# Altium schematic sheet MCU.SchDoc
size A3; SheetNumber: 4; SheetTotal: 6
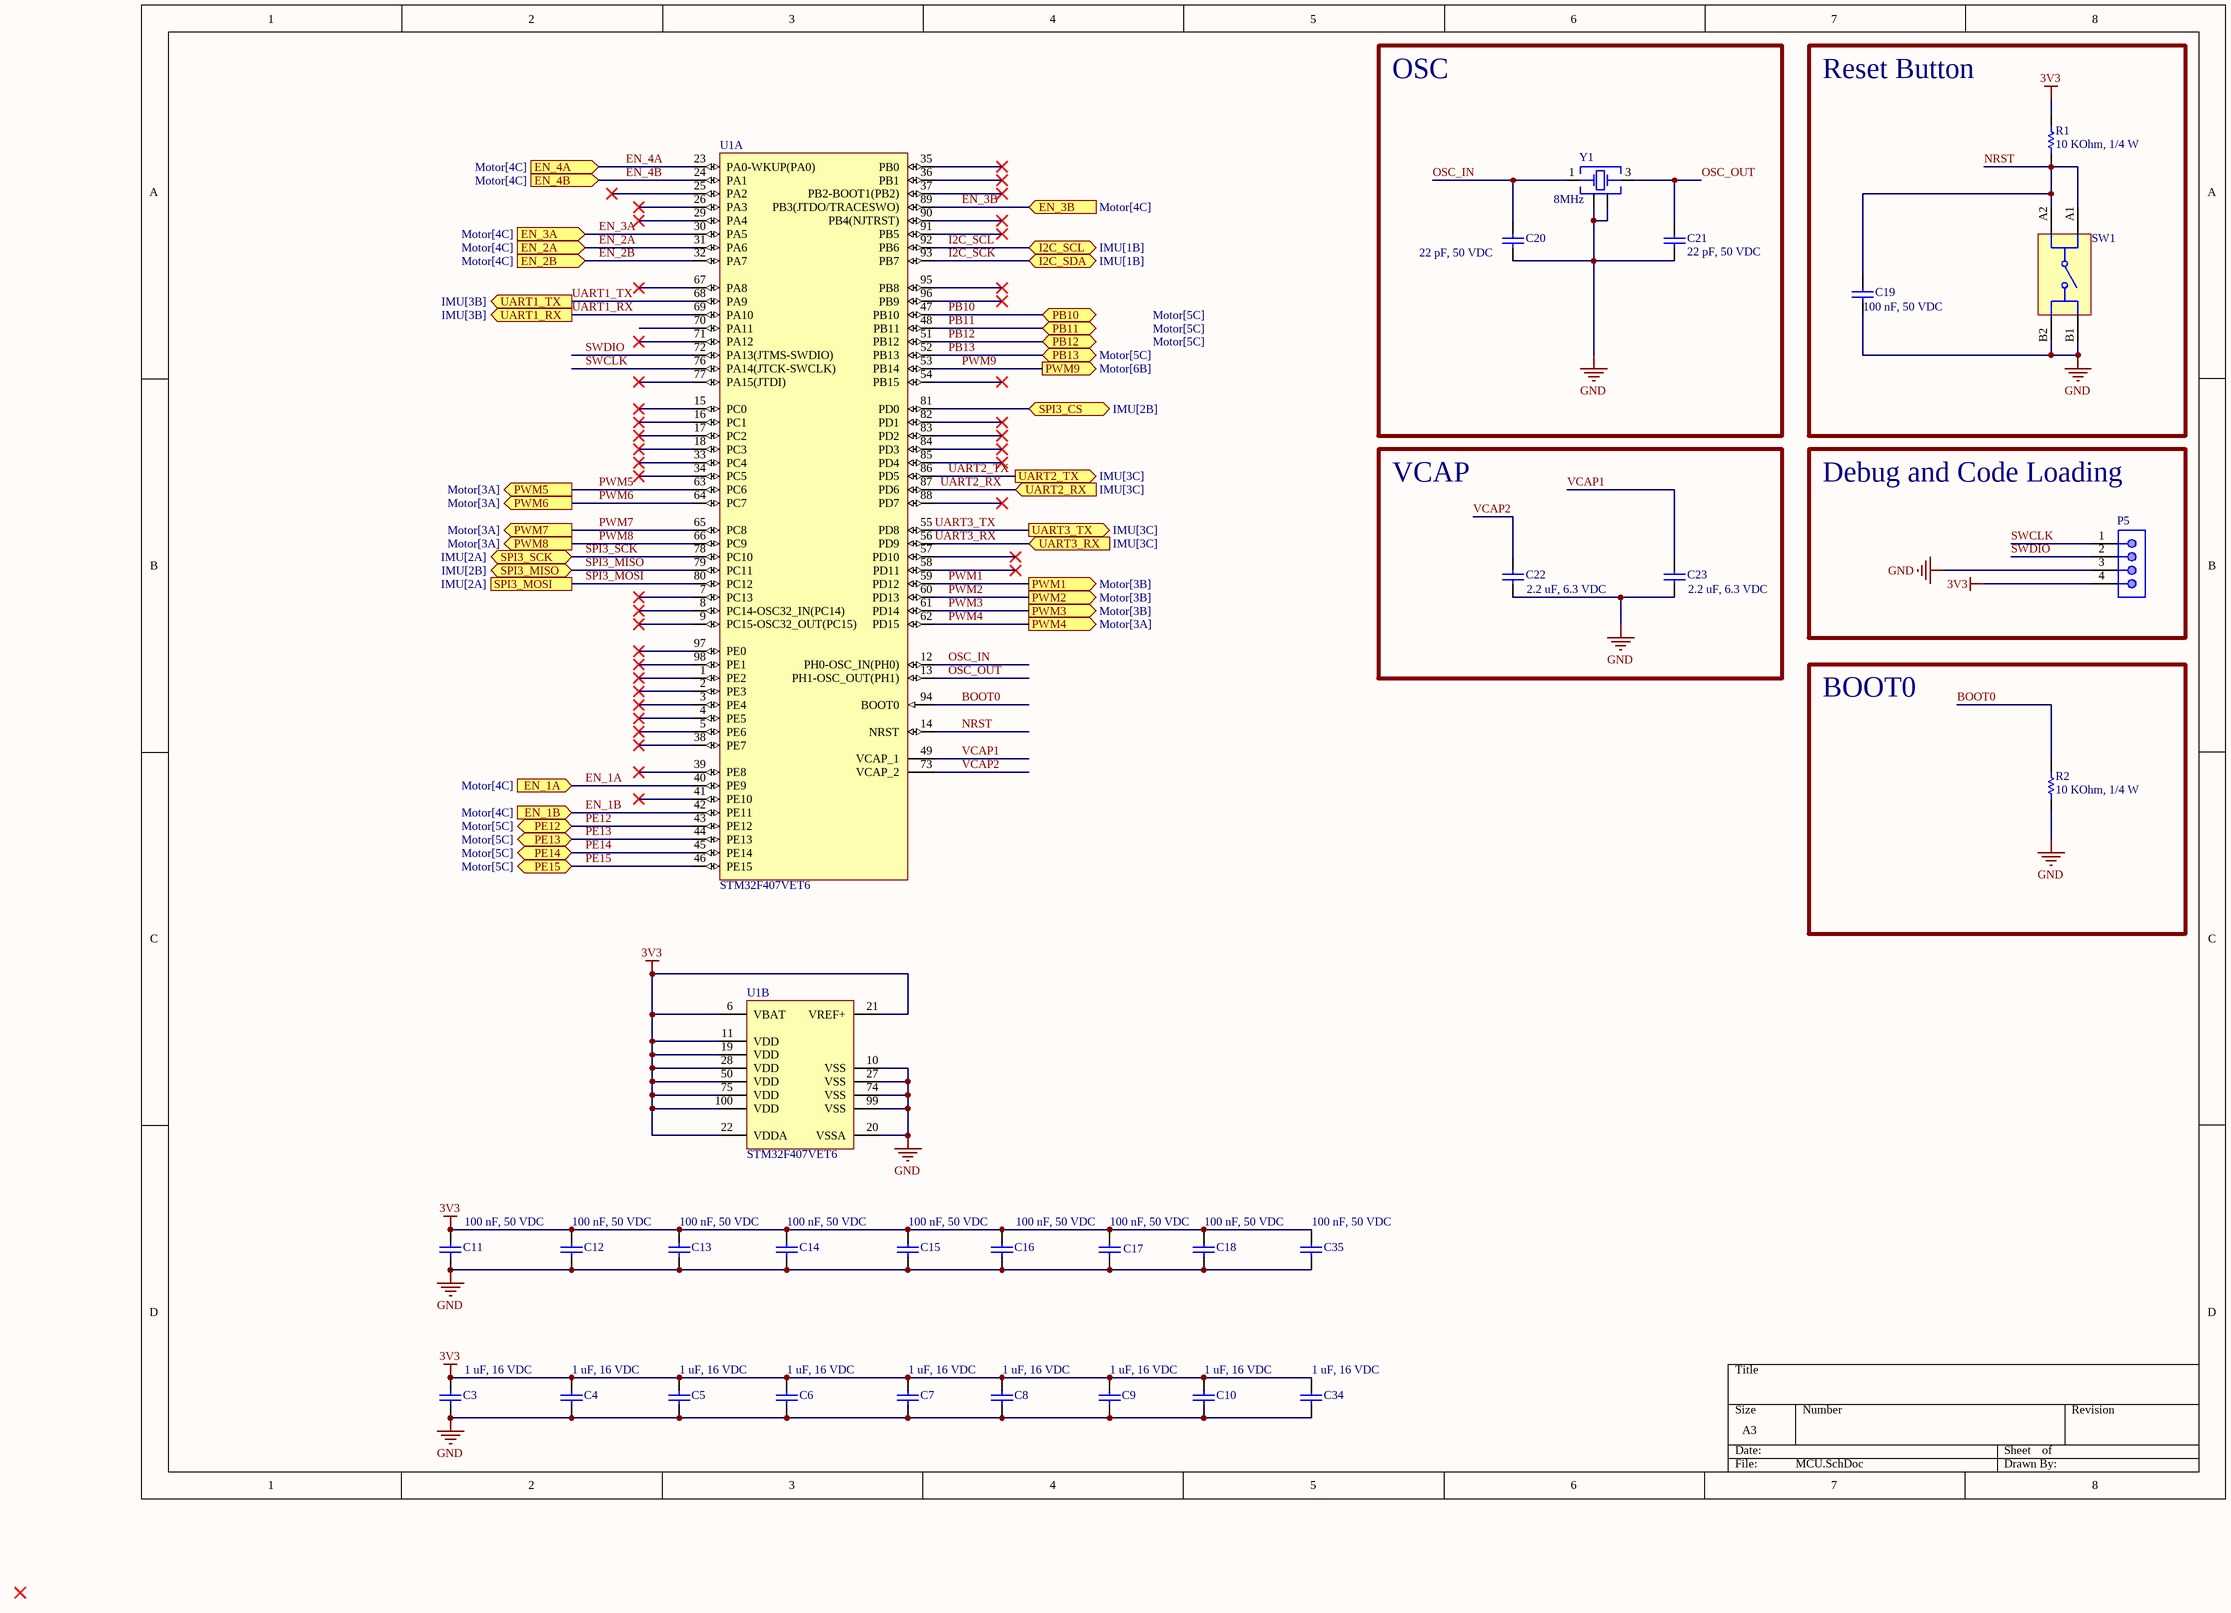
[diagram p0: MCU.SchDoc]

## Parts
C3  1 uF, 16 VDC  [CAP_0603]
C4  1 uF, 16 VDC  [CAP_0603]
C5  1 uF, 16 VDC  [CAP_0603]
C6  1 uF, 16 VDC  [CAP_0603]
C7  1 uF, 16 VDC  [CAP_0603]
C8  1 uF, 16 VDC  [CAP_0603]
C9  1 uF, 16 VDC  [CAP_0603]
C10  1 uF, 16 VDC  [CAP_0603]
C11  100 nF, 50 VDC  [CAP_0603]
C12  100 nF, 50 VDC  [CAP_0603]
C13  100 nF, 50 VDC  [CAP_0603]
C14  100 nF, 50 VDC  [CAP_0603]
C15  100 nF, 50 VDC  [CAP_0603]
C16  100 nF, 50 VDC  [CAP_0603]
C17  100 nF, 50 VDC  [CAP_0603]
C18  100 nF, 50 VDC  [CAP_0603]
C19  100 nF, 50 VDC  [CAP_0603]
C20  22 pF, 50 VDC  [CAP_0603]
C21  22 pF, 50 VDC  [CAP_0603]
C22  2.2 uF, 6.3 VDC  [CAP_0603]
C23  2.2 uF, 6.3 VDC  [CAP_0603]
C34  1 uF, 16 VDC  [CAP_0603]
C35  100 nF, 50 VDC  [CAP_0603]
P5  61300411121  [61300411121]  (value not drawn)
R1  10 KOhm, 1/4 W  [resistor_0603]
R2  10 KOhm, 1/4 W  [resistor_0603]
SW1  430483035816  [WS-TASV_L6W6H3.5_4304x30358x6]  (value not drawn)
U1  STM32F407VET6  [STM-LQFP100_V]  (parts A,B of 2)
Y1  8MHz  [WE-XTAL_CFPX-104]

## Blocks framed on the sheet
OSC: C20 C21 Y1
Reset Button: C19 R1 SW1
VCAP: C22 C23
Debug and Code Loading: P5
BOOT0: R2

## Ports
EN_1A (in, see Motor[4C]), EN_1B (in, see Motor[4C]), EN_2A (in, see Motor[4C]), EN_2B (in, see Motor[4C]), EN_3A (in, see Motor[4C]), EN_3B (in, see Motor[4C]), EN_4A (in, see Motor[4C]), EN_4B (in, see Motor[4C]), I2C_SCL (bidir, see IMU[1B]), I2C_SDA (bidir, see IMU[1B]), PB10 (bidir, see Motor[5C]), PB11 (bidir, see Motor[5C]), PB12 (bidir, see Motor[5C]), PB13 (bidir, see Motor[5C]), PE12 (bidir, see Motor[5C]), PE13 (bidir, see Motor[5C]), PE14 (bidir, see Motor[5C]), PE15 (bidir, see Motor[5C]), PWM1 (out, see Motor[3B]), PWM2 (out, see Motor[3B]), PWM3 (out, see Motor[3B]), PWM4 (out, see Motor[3A]), PWM5 (out, see Motor[3A]), PWM6 (out, see Motor[3A]), PWM7 (out, see Motor[3A]), PWM8 (out, see Motor[3A]), PWM9 (out, see Motor[6B]), SPI3_CS (bidir, see IMU[2B]), SPI3_MISO (bidir, see IMU[2B]), SPI3_MOSI (see IMU[2A]), SPI3_SCK (bidir, see IMU[2A]), UART1_RX (out, see IMU[3B]), UART1_TX (out, see IMU[3B]), UART2_RX (in, see IMU[3C]), UART2_TX (out, see IMU[3C]), UART3_RX (in, see IMU[3C]), UART3_TX (out, see IMU[3C])

## Nets
3V3: C3.2 C4.2 C5.2 C6.2 C7.2 C8.2 C9.2 C10.2 C11.2 C12.2 C13.2 C14.2 C15.2 C16.2 C17.2 C18.2 C34.2 C35.2 P5.4 R1.2 U1.6(VBAT) U1.11(VDD) U1.19(VDD) U1.21(VREF+) U1.22(VDDA) U1.28(VDD) U1.50(VDD) U1.75(VDD) U1.100(VDD)
GND: C3.1 C4.1 C5.1 C6.1 C7.1 C8.1 C9.1 C10.1 C11.1 C12.1 C13.1 C14.1 C15.1 C16.1 C17.1 C18.1 C19.1 C20.1 C21.1 C22.1 C23.1 C34.1 C35.1 P5.3 R2.1 SW1.B1 SW1.B2 U1.10(VSS) U1.20(VSSA) U1.27(VSS) U1.74(VSS) U1.99(VSS) Y1.2(GND) Y1.4(GND)
BOOT0: R2.2 U1.94(BOOT0)
EN_1A: U1.40(PE9) ; port EN_1A
EN_1B: U1.42(PE11) ; port EN_1B
EN_2A: U1.31(PA6) ; port EN_2A
EN_2B: U1.32(PA7) ; port EN_2B
EN_3A: U1.30(PA5) ; port EN_3A
EN_3B: U1.89(PB3(JTDO/TRACESWO)) ; port EN_3B
EN_4A: U1.23(PA0-WKUP(PA0)) ; port EN_4A
EN_4B: U1.24(PA1) ; port EN_4B
I2C_SCK: U1.93(PB7) ; port I2C_SDA
I2C_SCL: U1.92(PB6) ; port I2C_SCL
NRST: C19.2 R1.1 SW1.A1 SW1.A2 U1.14(NRST)
OSC_IN: C20.2 U1.12(PH0-OSC_IN(PH0)) Y1.1(OSC1)
OSC_OUT: C21.2 U1.13(PH1-OSC_OUT(PH1)) Y1.3(OSC2)
PB10: U1.47(PB10) ; port PB10
PB11: U1.48(PB11) ; port PB11
PB12: U1.51(PB12) ; port PB12
PB13: U1.52(PB13) ; port PB13
PE12: U1.43(PE12) ; port PE12
PE13: U1.44(PE13) ; port PE13
PE14: U1.45(PE14) ; port PE14
PE15: U1.46(PE15) ; port PE15
PWM1: U1.59(PD12) ; port PWM1
PWM2: U1.60(PD13) ; port PWM2
PWM3: U1.61(PD14) ; port PWM3
PWM4: U1.62(PD15) ; port PWM4
PWM5: U1.63(PC6) ; port PWM5
PWM6: U1.64(PC7) ; port PWM6
PWM7: U1.65(PC8) ; port PWM7
PWM8: U1.66(PC9) ; port PWM8
PWM9: U1.53(PB14) ; port PWM9
SPI3_CS: U1.81(PD0) ; port SPI3_CS
SPI3_MISO: U1.79(PC11) ; port SPI3_MISO
SPI3_MOSI: U1.80(PC12) ; port SPI3_MOSI
SPI3_SCK: U1.78(PC10) ; port SPI3_SCK
SWCLK: P5.1 U1.76(PA14(JTCK-SWCLK))
SWDIO: P5.2 U1.72(PA13(JTMS-SWDIO))
UART1_RX: U1.69(PA10) ; port UART1_RX
UART1_TX: U1.68(PA9) ; port UART1_TX
UART2_RX: U1.87(PD6) ; port UART2_RX
UART2_TX: U1.86(PD5) ; port UART2_TX
UART3_RX: U1.56(PD9) ; port UART3_RX
UART3_TX: U1.55(PD8) ; port UART3_TX
VCAP1: C23.2 U1.49(VCAP_1)
VCAP2: C22.2 U1.73(VCAP_2)

Not connected (* = marked no-connect by the designer): U1 1(PE2)* 2(PE3)* 3(PE4)* 4(PE5)* 5(PE6)* 7(PC13)* 8(PC14-OSC32_IN(PC14))* 9(PC15-OSC32_OUT(PC15))* 15(PC0)* 16(PC1)* 17(PC2)* 18(PC3)* 25(PA2)* 26(PA3)* 29(PA4)* 33(PC4)* 34(PC5)* 35(PB0)* 36(PB1)* 37(PB2-BOOT1(PB2))* 38(PE7)* 39(PE8)* 41(PE10)* 54(PB15)* 57(PD10)* 58(PD11)* 67(PA8)* 70(PA11) 71(PA12)* 77(PA15(JTDI))* 82(PD1)* 83(PD2)* 84(PD3)* 85(PD4)* 88(PD7)* 90(PB4(NJTRST))* 91(PB5)* 95(PB8)* 96(PB9)* 97(PE0)* 98(PE1)*

## Library data of the parts
C3-C10 C34 = 0106031051016: CAP, size 0603, 1 uF, 16 VDC; Manufacture Name: Samsung Electro-Mechanics; Manufacture SN: CL10B105KO8NNWC; Capacitance: 1 uF; Tolerance: +/-10%; Voltage Rating DC: 16 VDC; ComponentLink2Description: Datasheet; ComponentLink2URL: https://www.mouser.vn/datasheet/2/585/Samsung_MLCC_1837944-1929650.pdf; Operating Temperature: -55 to +125degC; Packaging: Tape and Reel; Mounting Technology: SMT; Size: 0603; Supplier 1 Name: Mouser; Supplier 1 SN: 187-CL10B105KO8NNWC; Supplier 1 URL: https://www.mouser.vn/ProductDetail/Samsung-Electro-Mechanics/CL10B105KO8NNWC?qs=81r%252BiQLm7BT%252BXtc72qn1ug%3D%3D&utm_source=mouser-refine-download&utm_medium=file&utm_campaign=CL10B105KO8NNWC&utm_content=Samsung-Electro-Mechanics; Supplier 2 Name: Digi-Key; Supplier 2 SN: 1276-CL10B105KO8NNWCTR-ND; Supplier 2 URL: https://www.digikey.com/en/products/detail/samsung-electro-mechanics/cl10b105ko8nnwc/16572783; Supplier 3 Name: thegioiic; Supplier 3 SN: N/A; Supplier 3 URL: https://www.thegioiic.com/tu-gom-0603-1uf-16v; Value: 1 uF, 16 VDC
C11-C19 C35 = 0106031041050: CAP, size 0603, 100 nF, 50 VDC; Manufacture Name: TDK; Manufacture SN: CGA3E3X8R1H104K080AE; Capacitance: 100 nF; Tolerance: +/-10%; Voltage Rating DC: 50 VDC; ComponentLink2Description: Datasheet; ComponentLink2URL: https://product.tdk.com/system/files/dam/doc/product/capacitor/ceramic/mlcc/catalog/mlcc_automotive_soft_en.pdf?ref_disty=mouser; Operating Temperature: -55 to +125degC; Packaging: Tape and Reel; Mounting Technology: SMT; Size: 0603; Supplier 1 Name: Mouser; Supplier 1 SN: 810-CGA3E3X8R1H104KA; Supplier 1 URL: https://www.mouser.com/ProductDetail/TDK/CGA3E3X8R1H104K080AE?qs=nQSIdc08i%252Bd8g3IRRgU2bw%3D%3D&utm_source=mouser-refine-download&utm_medium=file&utm_campaign=CGA3E3X8R1H104K080AE&utm_content=TDK; Supplier 2 Name: Digi-Key; Supplier 2 SN: 445-173697-2-ND; Supplier 2 URL: https://www.digikey.com/en/products/detail/tdk-corporation/cga3e3x8r1h104k080ae/5809262; Supplier 3 Name: thegioiic; Supplier 3 SN: N/A; Supplier 3 URL: N/A; Value: 100 nF, 50 VDC
C20 C21 = 0106032200550: CAP, size 0603, 22 pF, 50 VDC; Manufacture Name: TDK; Manufacture SN: CGA3E2NP01H220J080AA; Capacitance: 22 pF; Tolerance: +/-5%; Voltage Rating DC: 50 VDC; ComponentLink2Description: Datasheet; ComponentLink2URL: https://product.tdk.com/system/files/dam/doc/product/capacitor/ceramic/mlcc/catalog/mlcc_automotive_hightemp_en.pdf?ref_disty=mouser; Operating Temperature: -55 to +125degC; Packaging: Tape and Reel; Mounting Technology: SMT; Size: 0603; Supplier 1 Name: Mouser; Supplier 1 SN: 810-CGA3E2NP01H220JA; Supplier 1 URL: https://www.mouser.com/ProductDetail/TDK/CGA3E2NP01H220J080AA?qs=xLDY6iXSiQbIDiPJq57tVA%3D%3D&utm_source=mouser-refine-download&utm_medium=file&utm_campaign=CGA3E2NP01H220J080AA&utm_content=TDK; Supplier 2 Name: Digi-Key; Supplier 2 SN: 445-12401-2-ND; Supplier 2 URL: https://www.digikey.com/en/products/detail/tdk-corporation/cga3e2np01h220j080aa/3949637; Supplier 3 Name: thegioiic; Supplier 3 SN: N/A; Supplier 3 URL: N/A; Value: 22 pF, 50 VDC
C22 C23 = 010603225106.3: CAP, size 0603, 2.2 uF, 6.3 VDC; Manufacture Name: Samsung Electro-Mechanics; Manufacture SN: CL10B225KQ8NNNC; Capacitance: 2.2 uF; Tolerance: +/-10%; Voltage Rating DC: 6.3 VDC; ComponentLink2Description: Datasheet; ComponentLink2URL: https://www.mouser.vn/datasheet/2/585/MLCC-1837944.pdf; Operating Temperature: -55 to +125degC; Packaging: Tape and Reel; Mounting Technology: SMT; Size: 0603; Supplier 1 Name: Mouser; Supplier 1 SN: 187-CL10B225KQ8NNNC; Supplier 1 URL: https://www.mouser.vn/ProductDetail/Samsung-Electro-Mechanics/CL10B225KQ8NNNC?qs=349EhDEZ59rhKTQnNCSlcg%3D%3D&utm_source=mouser-refine-download&utm_medium=file&utm_campaign=CL10B225KQ8NNNC&utm_content=Samsung-Electro-Mechanics; Supplier 2 Name: Digi-Key; Supplier 2 SN: 1276-2018-2-ND; Supplier 2 URL: https://www.digikey.com/en/products/detail/samsung-electro-mechanics/cl10b225kq8nnnc/3887676; Supplier 3 Name: thegioiic; Supplier 3 SN: N/A; Supplier 3 URL: N/A; Value: 2.2 uF, 6.3 VDC
P5 = 61300411121: WR-PHD Pin Header, THT, pitch 2.54mm, Single Row, Vertical, 4p; Manufacturer: Wurth Elektronik; Pin Number: 4; Rated Current: 3A; Working Voltage: 250VAC; Withstanding Voltage: 500VAC; Contact Resistance: 20mOhm; Supply Name 1: Mouser; ComponentLink1Description: Manufacturer; ComponentLink1URL: http://www.we-online.de; ComponentLink2Description: Datasheet; ComponentLink2URL: https://www.we-online.com/catalog/datasheet/61300411121.pdf; Manufacturer Part Number: 61300411121; Published Date: May 2020; Pitch: 2.54mm; Operating Temperature: -40 to +105degC; Mounting Technology: THT; Packaging: Bag; Gender: Pin Header; Row Number: Single; Orientation: Vertical; ComponentLink3Description: Global Supply; ComponentLink3URL: https://www.we-online.com/en/components/products/PHD_2_54_THT_PIN_HEADER_6130XX11121?sq=61300411121#61300411121; ComponentLink4Description: Global Supply; ComponentLink4URL: https://www.mouser.vn/ProductDetail/Wurth-Elektronik/61300411121?qs=PhR8RmCirEYQcLLqXD8rAA%3D%3D; Supplier 1 Name: Mouser; Supplier 1 SN: 710-61300311121; Supplier 1 URL: https://www.mouser.vn/ProductDetail/Wurth-Elektronik/61300311121?qs=PhR8RmCirEYxRWFJzNKsUw%3D%3D; Supplier 2 Name: Digi-Key; Supplier 2 SN: N/A; Supplier 2 URL: N/A; Supplier 3 Name: thegioiic; Supplier 3 SN: N/A; Supplier 3 URL: N/A
R1 R2 = 0006031031: RES, size 0603, 10 KOhm, 1/4 W; Manufacture  Name: OEM; Resistance: 10 KOhm; Rated Power: 1/4 W; Resistance Tolerance: +/-1%; Size: 0603; Mounting Technology: SMT; Supplier 1 Name: Mouser; Supplier 1 SN: 755-ESR03EZPF1002; Supplier 2 Name: Digi-Key; Supplier 2 SN: RHM10KADTR-ND RHM10KADCT-ND RHM10KADDKR-ND; Supplier 1 URL: https://www.mouser.vn/ProductDetail/ROHM-Semiconductor/ESR03EZPF1002?qs=sGAEpiMZZMvdGkrng054t67Efho1F8r6CDeAsqwFse8%3D; Supplier 3 Name: thegioiic; Supplier 3 SN: N/A; Supplier 3 URL: N/A; Manufacture  SN: OEM; Value: 10 KOhm, 1/4 W; ComponentLink1Description: Datasheet link; ComponentLink1URL: https://fscdn.rohm.com/en/products/databook/datasheet/passive/resistor/chip_resistor/esr-e.pdf; ComponentLink2Description: Supplier 1 URL; ComponentLink2URL: N/A; ComponentLink3Description: Supplier 2 URL; ComponentLink3URL: https://www.digikey.com/en/products/detail/rohm-semiconductor/ESR03EZPF1002/1983429; ComponentLink4Description: Supplier 3 URL; ComponentLink4URL: N/A; Supplier 2 URL: https://www.digikey.com/en/products/detail/rohm-semiconductor/ESR03EZPF1002/1983429
SW1 = 430483035816: WS-TASV J-Bend SMT Washable Tact Switch, 12VDC, 50mA, 160g, height 3.5mm; Manufacturer: Wurth Elektronik; Rated Voltage: 12V; Washable: Yes; Actuator Color: Black; Electrical Life: 1000000Cycles; ComponentLink1Description: Manufacturer Link; ComponentLink1URL: http://www.we-online.de; ComponentLink2Description: Datasheet; ComponentLink2URL: https://www.we-online.com/catalog/datasheet/430483035816.pdf; Manufacturer Part Number: 430483035816; Contact Material: Stainless Steel; Mounting Technology: SMT; Contact Plating: Silver; Operation Force: 160g; Packaging: Tape and Reel; Terminal Material: Copper Alloy; Rated Current: 50mA; Terminal Plating: Silver; Height: 3.5mm; Length: 6mm; Operating Temperature max.: 85C; Operating Temperature min.: -40C; Width: 6mm
U1 = CMP-0243-00016-3: ARM Cortex-M4 32-bit MCU+FPU, 210 DMIPS, 512 kB Flash, 192 kB Internal RAM, 82 I/Os, 100-pin LQFP, -40 to 85 degC, Tray; Manufacturer: STMicroelectronics; Supply Voltage(Vcc) max (V): 3.6; Supply Voltage(Vcc) min (V): 1.8; I/Os (High Current): 82; FLASH Size (Prog) (kB): 512; Operating Frequency(F) (Processor speed) (MHz): 168; D/A Converter: 2x12-bit; Internal RAM Size (kB): 192; PackageReference: LQFP100; Core: ARM Cortex-M4; ComponentLink1URL: http://www.st.com/web/en/home.html; ComponentLink1Description: Manufacturer URL; DatasheetVersion: Rev. 4; Packing: Tray; Mounting Technology: Surface Mount; ComponentLink2Description: Datasheet; ComponentLink2URL: http://www.st.com/st-web-ui/static/active/en/resource/technical/document/datasheet/DM00037051.pdf; ComponentLink3Description: Package Specification; PartNumber: STM32F407VET6; PackageVersion: Rev. 1, 06/2013; PackageDescription: 100-Pin Low Profile Quad Flat Package, 14 x 14 mm Body, 0.5 mm Pitch; ComponentLink3URL: http://www.st.com/st-web-ui/static/active/en/resource/technical/document/data_brief/DM00071938.pdf
Y1 = 830106162701: WE-XTAL Quartz Crystal, SMT, CFPX-104, 8MHz, +/-20ppm; Manufacturer: Wurth Elektronik; Frequency Stability: +/-30ppm; Load Capacitance: 16pF; ComponentLink1Description: Manufacturer; ComponentLink1URL: http://www.we-online.de; ComponentLink2Description: Datasheet; ComponentLink2URL: https://www.we-online.com/catalog/datasheet/830106162701.pdf; Operating Temperature: -40 to +85degC; Packaging: Tape and Reel; Manufacturer Part Number: 830106162701; Published Date: November 2020; Size: CFPX-104; Frequency: 8MHz; Frequency Tolerance: +/-20ppm; Mounting Technology: SMT